# Altium schematic sheet ADC_PCM1802.SchDoc
size A4
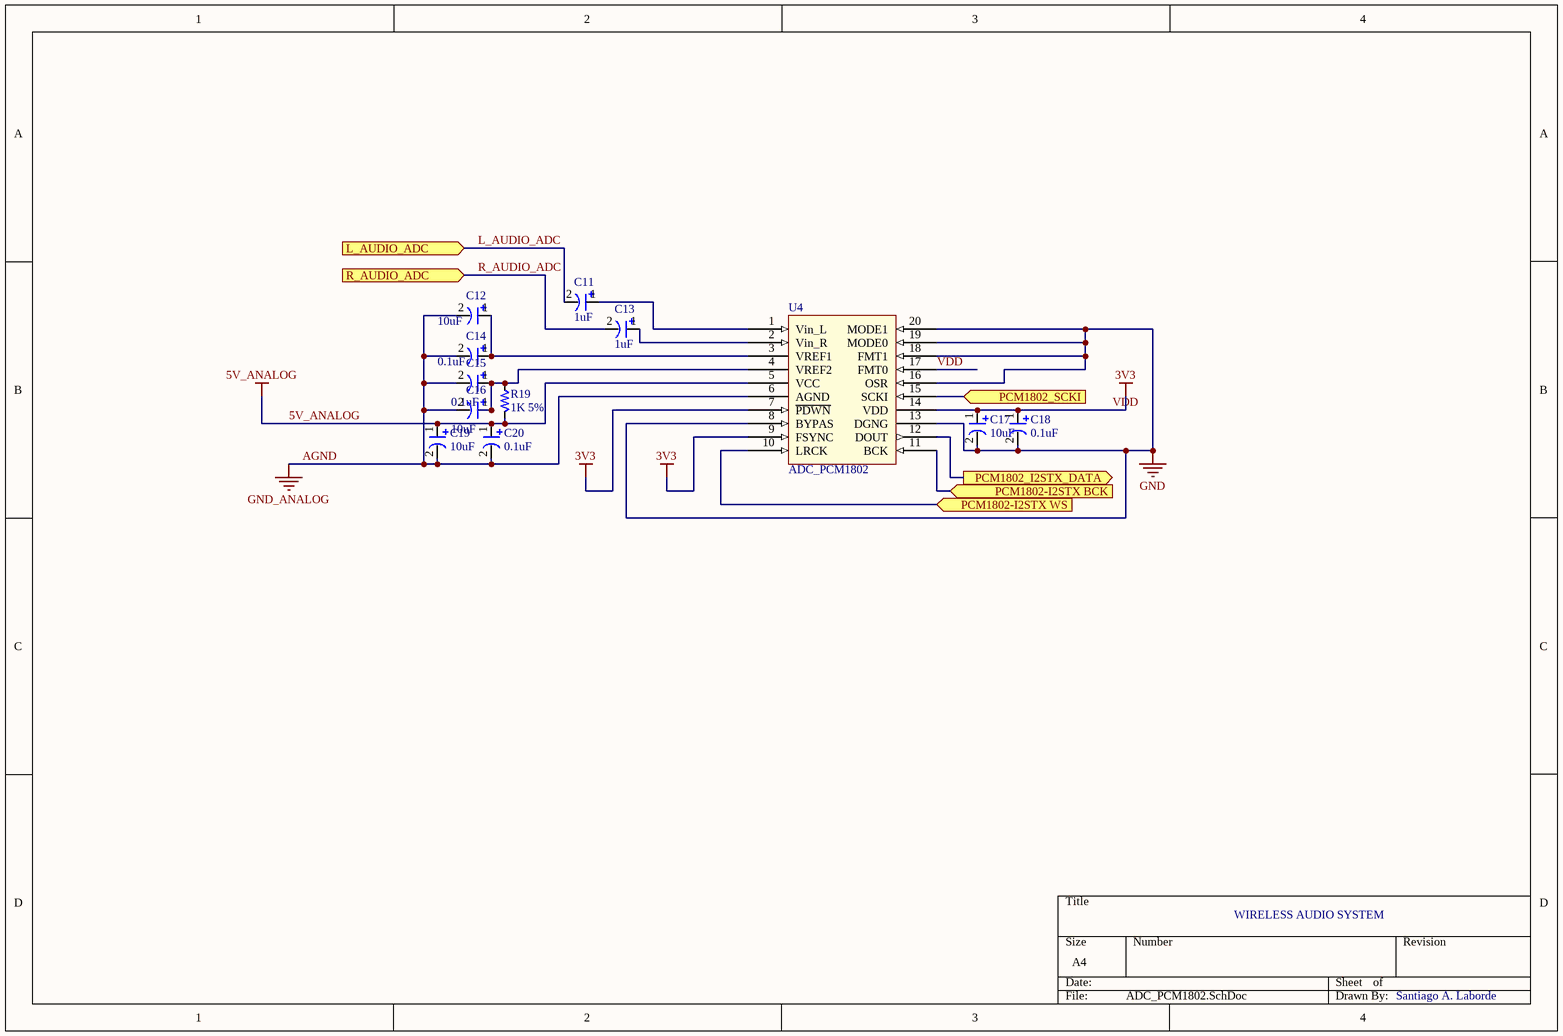
[diagram p0: ADC_PCM1802.SchDoc]

## Parts
C11  1uF  [RAD-0.1]
C12  10uF  [14-1210]
C13  1uF  [RAD-0.1]
C14  0.1uF  [C_0805_Pol]
C15  0.1uF  [C_0805_Pol]
C16  10uF  [14-1210]
C17  10uF  [14-1210]
C18  0.1uF  [C_0805_Pol]
C19  10uF  [14-1210]
C20  0.1uF  [C_0805_Pol]
R19  1K 5%  [R_0805]
U4  ADC_PCM1802  [SSOP (20)]

## Ports
L_AUDIO_ADC (in), PCM1802-I2STX BCK (in), PCM1802-I2STX WS (in), PCM1802_I2STX_DATA (out), PCM1802_SCKI (in), R_AUDIO_ADC (in)

## Nets
5V_ANALOG: C19.1 C20.1 R19.1 U4.5(VCC)
AGND: C12.2 C14.2 C15.2 C16.2 C19.2 C20.2 U4.6(AGND)  [also labelled GND_ANALOG]
GND: C17.2 C18.2 U4.8(BYPAS) U4.13(DGNG) U4.16(OSR) U4.18(FMT1) U4.19(MODE0) U4.20(MODE1)
VDD: C17.1 C18.1 U4.7(~{PDWN}) U4.9(FSYNC) U4.14(VDD) U4.17(FMT0)  [also labelled 3V3]
L_AUDIO_ADC: C11.2 ; port L_AUDIO_ADC
PCM1802-I2STX BCK: U4.11(BCK) ; port PCM1802-I2STX BCK
PCM1802-I2STX WS: U4.10(LRCK) ; port PCM1802-I2STX WS
PCM1802_I2STX_DATA: U4.12(DOUT) ; port PCM1802_I2STX_DATA
PCM1802_SCKI: U4.15(SCKI) ; port PCM1802_SCKI
R_AUDIO_ADC: C13.2 ; port R_AUDIO_ADC
NetC11_1: C11.1 U4.1(Vin_L)
NetC12_1: C12.1 C14.1 U4.3(VREF1)
NetC13_1: C13.1 U4.2(Vin_R)
NetC15_1: C15.1 C16.1 R19.2 U4.4(VREF2)

## Notes on the sheet
- WIRELESS AUDIO SYSTEM
- Santiago A. Laborde

## Library data of the parts
C11-C20 = Capacitor_Pol: Polarysed Capacitor
R19 = Resistor
U4 = ADC_PCM1802: The PCM1802 is a high-performance, low-cost, / single-chip stereo analog-to-digital converter with / single-ended analog voltage input. The PCM1802 / uses a delta-sigma modulator with 64-times or / 128‑times oversampling, and includes a digital / decimation filter and high-pass filter (HPF), which / removes the DC component of the input signal. For / various applications, the PCM1802 supports master / and slave modes and four data formats in serial / interface. The PCM1802 is suitable for a wide variety / of cost-sensitive consumer applications where good / performance, 5-V analog supply, and 3.3-V digital / supply operation is required. The PCM1802 is / fabricated using a highly advanced CMOS process / and is available in the DB 20-pin SSOP package.